# EAGLE design symasym_5_3 (EAGLE 4.15)
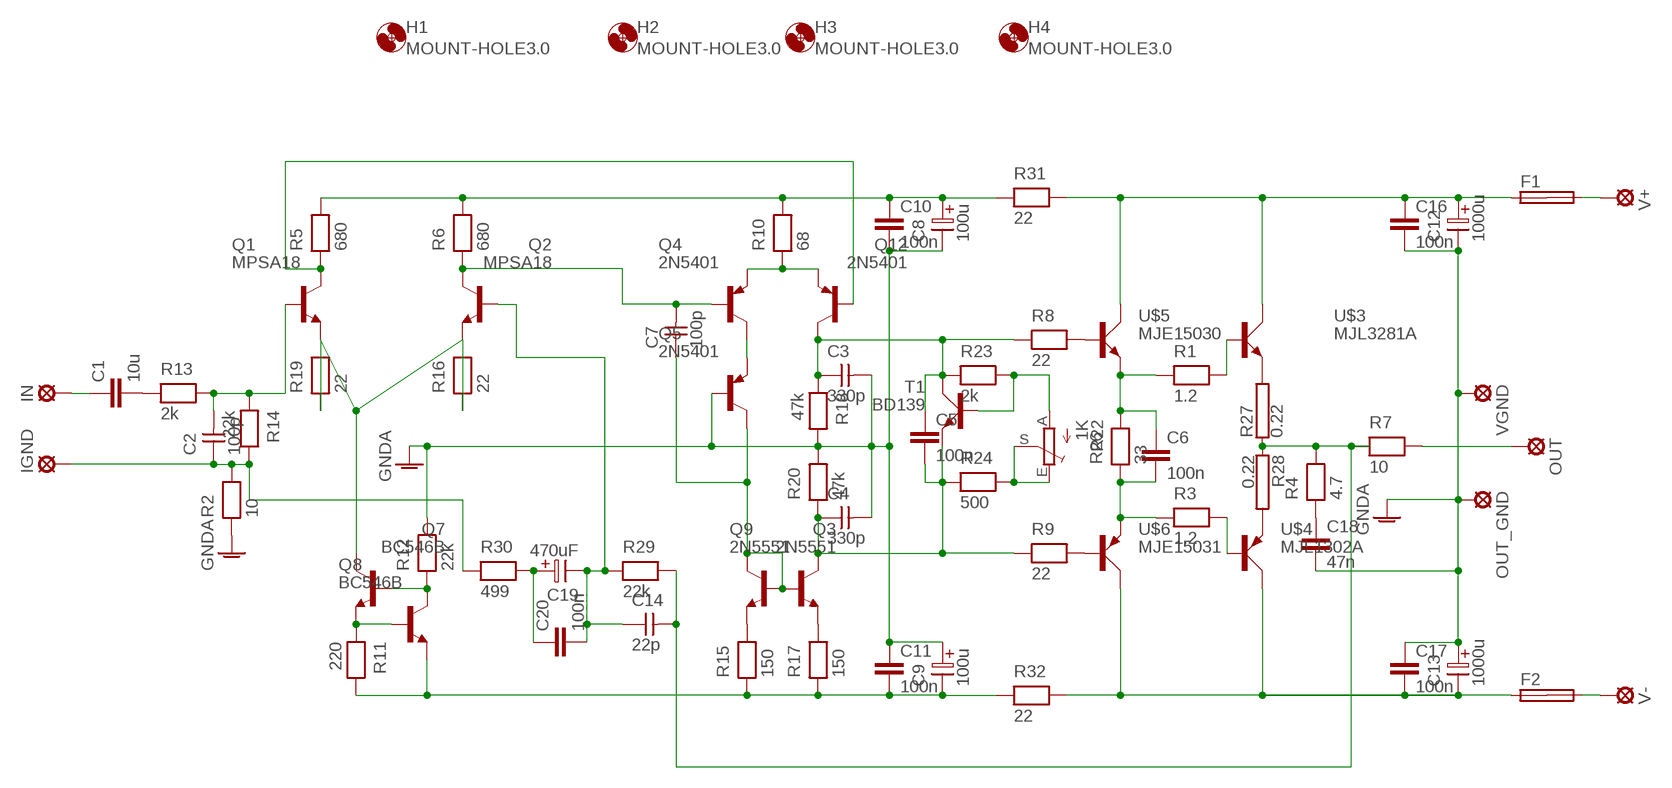
[diagram p0: schematic, sheet 1]

## Parts
C1  10u  C5/7.2  [C5B7.2]
C2  100p  CAPNP-2,5MICA  [C-3,75]
C3  330p  CAPNP-2,5MICA  [C-3,75]
C4  330p  CAPNP-2,5MICA  [C-3,75]
C5  100n  C5/2.5  [C5B2.5]
C6  100n  C5/3  [C5B3]
C7  100p  CAPNP-2,5MICA  [C-3,75]
C8  100u  ELC-5  [ES-5]
C9  100u  ELC-5  [ES-5]
C10  100n  C5/3.5  [C5B3.5]
C11  100n  C5/3.5  [C5B3.5]
C12  1000u  ELC-7,5  [ES-7,5]
C13  1000u  ELC-7,5  [ES-7,5]
C14  22p  CAPNP-2,5MICA  [C-3,75]
C16  100n  C5/3  [C5B3]
C17  100n  C5/3  [C5B3]
C18  47n  C5/3  [C5B3]
C19  470uF  ELC-5  [ES-5]
C20  100n  C5/3  [C5B3]
F1  SHK20L  [SHK20L]
F2  SHK20L  [SHK20L]
H1  MOUNT-HOLE3.0  [3,0]
H2  MOUNT-HOLE3.0  [3,0]
H3  MOUNT-HOLE3.0  [3,0]
H4  MOUNT-HOLE3.0  [3,0]
IGND  SE11  [SE11]
IN  SE11  [SE11]
OUT  SE11  [SE11]
OUT_GND  SE11  [SE11]
Q1  MPSA18  [TO92-EBC@1]
Q2  MPSA18  [TO92-EBC@1]
Q3  2N5551  [TO92-EBC@1]
Q4  2N5401  [TO92-EBC]
Q5  2N5401  [TO92-EBC]
Q7  BC546B  [TO92-EBC]
Q8  BC546B  [TO92-EBC]
Q9  2N5551  [TO92-EBC@1]
Q12  2N5401  [TO92-EBC]
R1  1.2  RESEU-18  [R-18]
R2  10  RESEU-10  [R-10]
R3  1.2  RESEU-18  [R-18]
R4  4.7  RESEU-18  [R-18]
R5  680  RESEU-10  [R-10]
R6  680  RESEU-10  [R-10]
R7  10  RESEU-18  [R-18]
R8  22  RESEU-10  [R-10]
R9  22  RESEU-10  [R-10]
R10  68  RESEU-10  [R-10]
R11  220  RESEU-S2,5  [RS-2,5]
R12  22k  RESEU-10  [R-10]
R13  2k  RESEU-S2,5  [RS-2,5]
R14  22k  RESEU-S2,5  [RS-2,5]
R15  150  RESEU-10  [R-10]
R16  22  RESEU-S2,5  [RS-2,5]
R17  150  RESEU-10  [R-10]
R18  47k  RESEU-S2,5  [RS-2,5]
R19  22  RESEU-S2,5  [RS-2,5]
R20  47k  RESEU-S2,5  [RS-2,5]
R22  1K  TRIM_EU-LI10  [LI10]
R23  2k  RESEU-10  [R-10]
R24  500  RESEU-10  [R-10]
R26  33  RESEU-10  [R-10]
R27  0.22  RKH208-8R  [KH208R-8]
R28  0.22  RKH208-8R  [KH208R-8]
R29  22k  RESEU-10  [R-10]
R30  499  RESEU-10  [R-10]
R31  22  RESEU-10  [R-10]
R32  22  RESEU-10  [R-10]
T1  BD139  [TO126AV]
U$3  MJL3281A  [TO247BV]
U$4  MJL1302A  [TO247BV]
U$5  MJE15030  [TO220AV]
U$6  MJE15031  [TO220AV]
V+  SE11  [SE11]
V-  SE11  [SE11]
VGND  SE11  [SE11]

## Nets
+24V: C8.1 C10.1 R5.2 R6.2 R10.2 R31.1
-24V: C9.2 C11.2 Q8.E R11.2 R15.1 R17.1 R32.1
N$1: Q3.E R15.2
N$2: R1.2 U$3.G(B)
N$3: Q7.C R16.2 R19.2
N$4: Q4.C Q5.E
N$5: R3.2 U$4.G(B)
N$6: Q9.E R17.2
N$7: C12.1 C16.1 F1.1A R31.2 U$3.D(C) U$5.C
N$8: C7.P$2 Q2.C Q4.B R6.1
N$9: C3.P$1 C5.1 Q12.C R8.1 R18.1 R23.1 T1.C
N$10: C7.P$1 Q3.B Q3.C Q5.C Q9.B
N$11: R8.2 U$5.B
N$12: R9.2 U$6.B
N$13: C1.2 R13.1
N$14: C18.1 R4.1
N$15: C2.P$1 IGND.MP R2.2 R14.2 R30.1
N$17: Q7.E Q8.B R11.1
N$18: Q4.E Q12.E R10.1
N$19: Q7.B Q8.C R12.1
N$20: C1.1 IN.MP
N$21: C2.P$2 Q1.B R13.2 R14.1
N$23: Q1.C Q12.B R5.1
N$27: C19.1 C20.1 R30.2
N$30: R22.A R23.2 T1.B
N$31: R22.E R22.S R24.2
N$32: C13.2 C17.2 F2.1A R32.2 U$4.D(C) U$6.C
N$33: C14.P$1 C19.2 C20.2 Q2.B R29.1
N$35: OUT.MP R7.2
N$37: R27.2 U$3.S(E)
N$38: R28.2 U$4.S(E)
N$41: C14.P$2 R4.2 R7.1 R27.1 R28.1 R29.2
N$42: F2.2A V-.MP
N$43: C4.P$1 C5.2 Q9.C R9.1 R20.1 R24.1 T1.E
N$44: F1.2A V+.MP
N$46: C6.1 R1.1 R26.2 U$5.E
N$47: C6.2 R3.1 R26.1 U$6.E
N$68: C3.P$2 C4.P$2 C8.2 C9.1 C10.2 C11.1 C12.2 C13.1 C16.2 C17.1 C18.2 OUT_GND.MP Q5.B R2.1 R12.2 R18.2 R20.2 VGND.MP ; supply symbol labelled GNDA
N$69: Q2.E R16.1
N$70: Q1.E R19.1
Unconnected: F1.1B F1.2B F2.1B F2.2B

## Library data of the parts
C1 C5 C6 C10 C11 C16-C18 C20 = capacitor-wima:C: CAPACITOR naming: grid - package width
C2-C4 C7 C14 = discrete:CAPNP-2,5
C8 C9 C19 = discrete:ELC-5
C12 C13 = discrete:ELC-7,5
F1 F2 = fuse:SHK20L: FUSE HOLDER 5 x 20 mm, SH contact, SHH1 Schukat, E1073 Buerklin
H1-H4 = holes:MOUNT-HOLE: MOUNTING HOLE with drill center marker
IGND IN OUT OUT_GND V+ V- VGND = solpad:SE11: SOLDER PAD RTM, drill 1,1mm, distributor Buerklin, 07F810
Q1 Q2 = transistor-npn:MPSA18
Q3 Q9 = transistor-npn:2N5551
Q4 Q5 Q12 = transistor-pnp:2N5401
Q7 Q8 = transistor-npn:BC546*: NPN Transistor
R1 R3 R4 R7 = discrete:RESEU-18
R2 R5 R6 R8-R10 R12 R15 R17 R23 R24 R26 R29-R32 = discrete:RESEU-10
R11 R13 R14 R16 R18-R20 = discrete:RESEU-S2,5
R22 = pot:TRIM_EU-: POTENTIOMETER
R27 R28 = resistor-power:R: Power Resitor
T1 = transistor-power:BD139: NPN TRANSISTOR
U$3 = transistor-power:MJL3281A
U$4 = transistor-power:MJL1302A
U$5 = transistor-power:MJE15030
U$6 = transistor-power:MJE15031

## Board
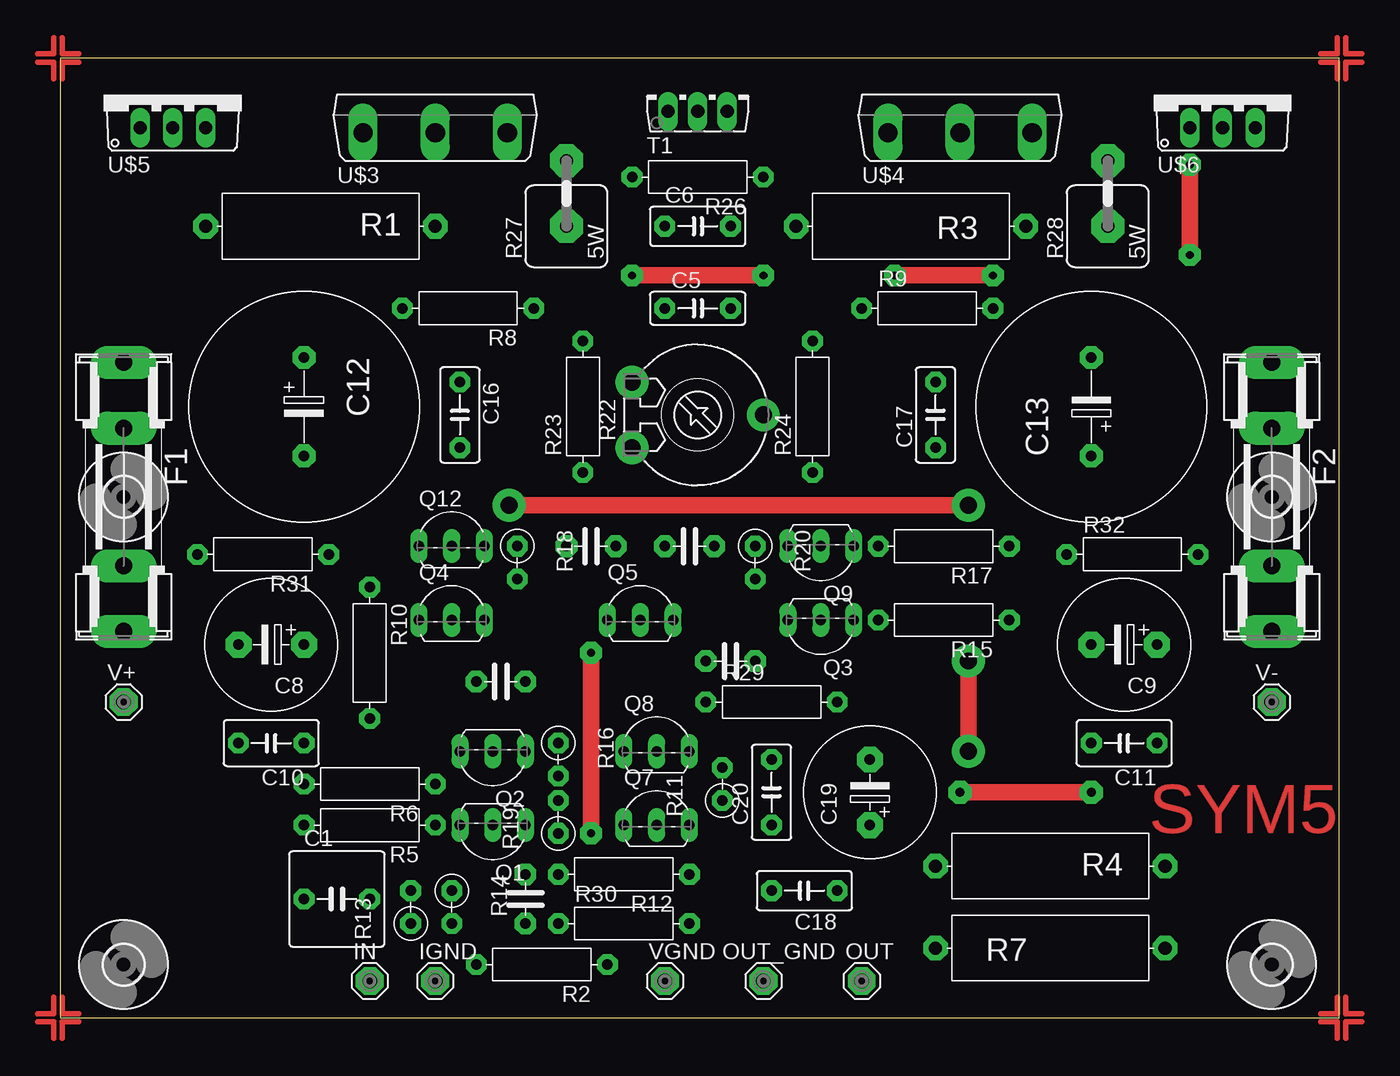
[diagram p1: board, top side]
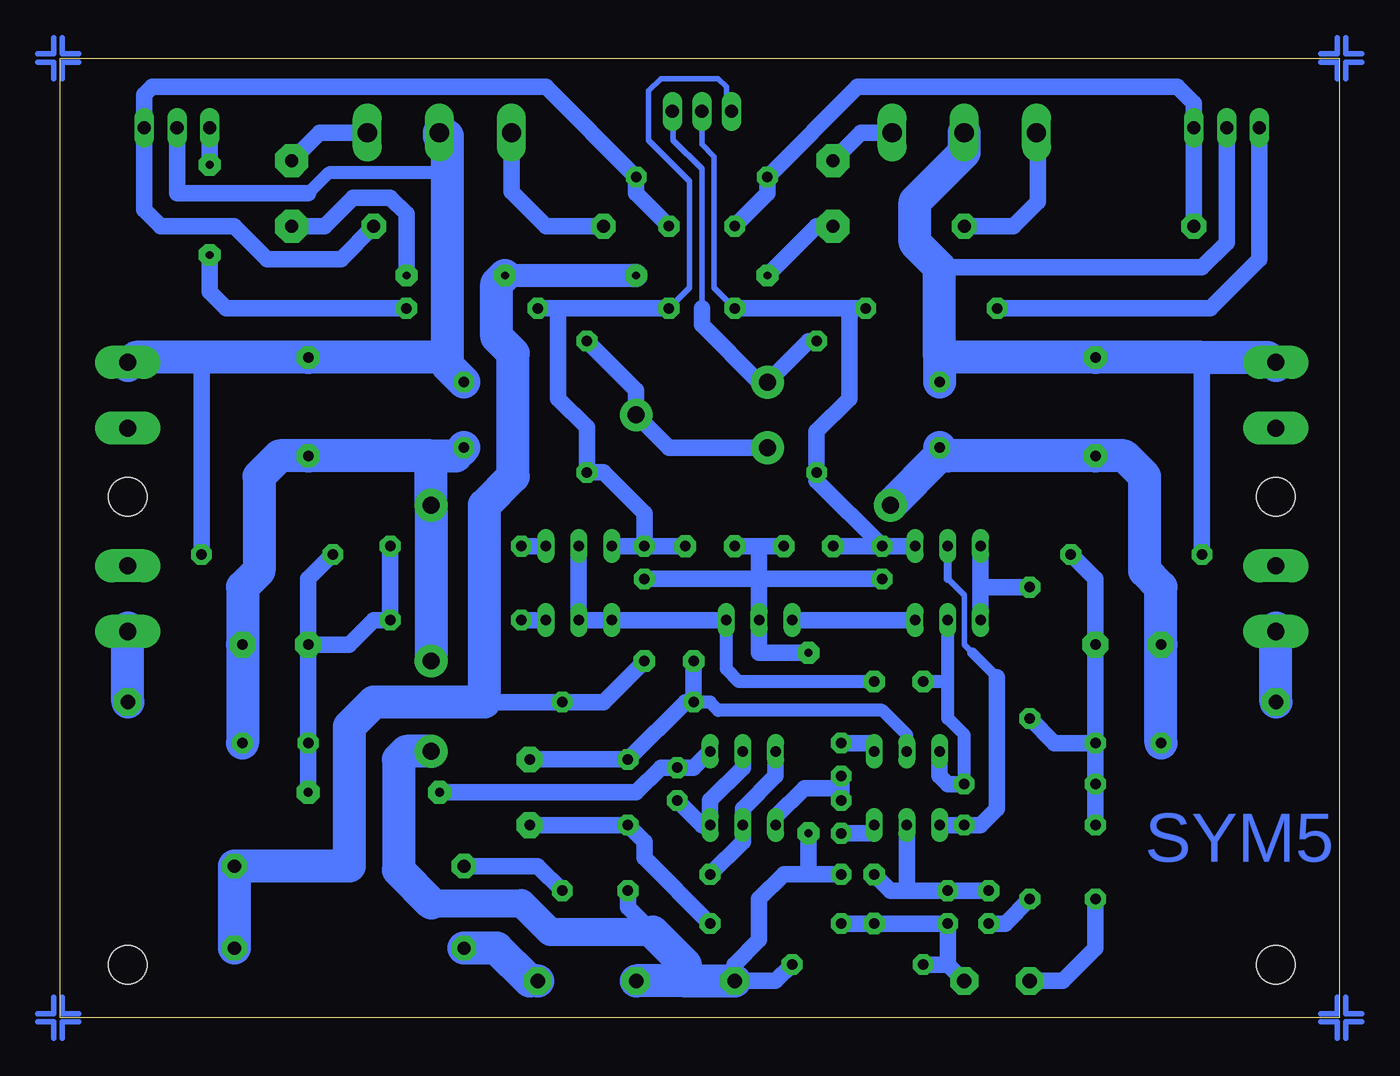
[diagram p2: board, bottom side, seen from below]

Size 99.05 x 74.28 mm. Coordinates in mm from the lower left corner, seen from the top.
Outline: 0,0 99.05,0 99.05,74.28 0,74.28 0,0
Copper layers (1*16): Top 0.035mm / dielectric 1.5mm / Bottom 0.035mm
Design rules "default": minimum track width 10mil, minimum drill 24mil, track to track 8mil, track to pad 8mil, pad to pad 8mil, via to via 8mil, smd to smd 8mil, copper to edge 40mil, drill to drill 8mil, minimum pad ring 10mil, minimum via ring 8mil, stop-mask expansion 4mil, vias tented up to drill 0mil, thermal gap 10mil

### Footprints (pad centres in the part's own frame; a part is rotated, then mirrored left to right if it is on the bottom)
C5B7.2 = drill 0.813 pad 1.6 octagon: 1 -2.54,0; 2 2.54,0
C-3,75 = drill 0.813 pad 1.676 octagon: P$1 -1.905,0; P$2 1.905,0
C5B2.5 = drill 0.813 pad 1.6 octagon: 1 -2.54,0; 2 2.54,0
C5B3 = drill 0.813 pad 1.6 octagon: 1 -2.54,0; 2 2.54,0
ES-5 = drill 0.813 pad 2.007 octagon: 1 -2.54,0; 2 2.54,0
C5B3.5 = drill 0.813 pad 1.6 octagon: 1 -2.54,0; 2 2.54,0
ES-7,5 = drill 0.813 pad 1.778 octagon: 1 -3.81,0; 2 3.81,0
SHK20L = drill 1.321 pad 2.54 long: 1A -10.414,0; 1B -5.334,0; 2A 10.414,0; 2B 5.334,0
3,0 = hole 3: 0,0
SE11 = drill 1.118 pad 2.159 octagon: MP 0,0
TO92-EBC@1 = drill 0.813 long: B 0,0; C 2.54,0; E -2.54,0
TO92-EBC = drill 0.813 long: B 0,-1.27; C -2.54,-1.27; E 2.54,-1.27
R-18 = drill 1.016 pad 1.905 octagon: 1 -8.89,0; 2 8.89,0
R-10 = drill 0.813 pad 1.6 octagon: 1 -5.08,0; 2 5.08,0
RS-2,5 = drill 0.813 pad 1.6 octagon: 1 0,0; 2 2.54,0
LI10 = drill 1.321 pad 2.54 round: A -2.54,-5.08; E 2.54,-5.08; S 0,5.08
KH208R-8 = drill 1.016 pad 2.54 octagon: 1 -2.54,0; 2 2.54,0
TO126AV = drill 1.016 long: B 2.286,-1.27; C 0,-1.27; E -2.286,-1.27
TO247BV = drill 1.499 long: D 0,-2.921; G -5.588,-2.921; S 5.588,-2.921
TO220AV = drill 1.016 long: B -2.54,-2.54; C 0,-2.54; E 2.54,-2.54

### Placement (x,y rotation side)
C1  21.43,9.2 0 top
C2  36.03,9.2 90 top
C3  41.11,36.51 0 top
C4  48.73,36.51 180 top
C5  49.36,54.92 0 top
C6  49.36,61.27 0 top
C7  34.12,26.03 180 top
C8  16.34,28.89 180 top
C9  82.39,28.89 180 top
C10  16.34,21.27 180 top
C11  82.39,21.27 180 top
C12  18.89,47.3 270 top
C13  79.84,47.3 90 top
C14  51.9,27.62 0 top
C16  30.95,46.67 270 top
C17  67.78,46.67 90 top
C18  57.62,9.84 180 top
C19  62.7,17.46 90 top
C20  55.08,17.46 90 top
F1  4.92,40.32 270 top
F2  93.81,40.32 270 top
H1  93.81,4.12 0 top
H2  4.92,4.12 0 top
H3  93.81,40.32 0 top
H4  4.92,40.32 0 top
IGND  29.05,2.85 0 top
IN  23.96,2.85 0 top
OUT  62.06,2.85 0 top
OUT_GND  54.45,2.85 0 top
Q1  33.49,14.92 180 top
Q2  33.49,20.63 180 top
Q3  58.89,30.79 180 top
Q4  2N5401  [TO92-EBC@1]  30.32,30.79 0 top
Q5  2N5401  [TO92-EBC@1]  44.92,30.79 0 top
Q7  46.19,16.19 0 top
Q8  46.19,21.9 0 top
Q9  58.89,36.51 180 top
Q12  2N5401  [TO92-EBC@1]  30.32,36.51 0 top
R1  20.16,61.27 0 top
R2  37.3,4.12 180 top
R3  65.88,61.27 180 top
R4  76.67,11.74 0 top
R5  23.96,14.92 180 top
R6  23.96,18.09 180 top
R7  76.67,5.39 180 top
R8  31.59,54.92 180 top
R9  67.15,54.92 0 top
R10  23.96,28.25 270 top
R11  51.27,16.82 90 top
R12  43.65,11.11 180 top
R13  27.14,7.3 90 top
R14  30.32,9.84 270 top
R15  68.42,30.79 180 top
R16  38.57,21.27 270 top
R17  68.42,36.51 180 top
R18  35.39,36.51 270 top
R19  38.57,14.28 90 top
R20  53.81,36.51 270 top
R22  49.36,46.67 270 top
R23  40.47,47.3 90 top
R24  58.25,47.3 90 top
R26  49.36,65.08 180 top
R27  39.2,63.81 90 top
R28  81.12,63.81 90 top
R29  55.08,24.44 0 top
R30  43.65,7.3 0 top
R31  15.71,35.87 180 top
R32  83.02,35.87 0 top
T1  49.36,71.43 0 top
U$3  29.05,71.43 0 top
U$4  69.69,71.43 0 top
U$5  8.72,71.43 0 top
U$6  90.01,71.43 0 top
V+  4.92,24.44 0 top
V-  93.81,24.44 0 top
VGND  46.82,2.85 0 top

### Tracks (layer width: path | path; a pad name or v marks a point on that pad's centre or on a via)
+24V
  Bottom 1.27: R31.1 18.89,33.97 C8.1 C10.1 | R5.2 R6.2 C10.1 | C10.1 22.06,21.27 R10.2
-24V  (via drill 0.7 pad 1.78)
  Top 1.27: v69.69,17.46 v79.84,17.46
  Bottom 1.27: C9.2 79.84,33.97 R32.1 | C9.2 C11.2 v79.84,17.46 | R17.1 R15.1 74.77,30.79 76.67,28.89 C9.2 | Q8.E 50,19.36 R11.2 52.54,19.36 54.45,17.46 v69.69,17.46
N$1
  Bottom 1.27: Q3.E R15.2
N$2
  Bottom 1.27: R1.2 25.23,61.27 23.33,63.18 23.33,68.89 23.46,68.77 U$3.G
N$3
  Bottom 1.27: Q7.C 43.65,15.55 41.43,17.77 38.57,17.77 | R19.2 38.57,17.77 | 38.57,17.77 R16.2
N$4
  Bottom 1.27: Q4.C Q5.E
N$5
  Bottom 1.27: U$4.G 64.1,63.94 61.43,61.27 R3.2
N$6
  Bottom 1.27: Q9.E R17.2
N$7
  Bottom 1.27: U$5.C 8.72,60 10.63,58.1 30.95,58.1 | R31.2 10.63,51.11
  Bottom 2.54: 30.95,51.11 C12.1 10.63,51.11 5.55,51.11 4.92,50.48 F1.1A | 30.95,51.11 C16.1 | 30.95,51.11 30.95,58.1 32.85,60 32.85,63.18 29.05,66.99 U$3.D
N$8
  Bottom 1.016: R6.1 29.05,21.9 30.32,23.17 30.32,26.03 | 30.32,26.03 Q4.B | 30.32,26.03 C7.P$2
  Bottom 1.27: R6.1 30.32,18.09 30.95,18.73 Q2.C
N$9
  Bottom 0.406: C5.1 48.41,56.51 48.41,66.67 49.36,67.62 T1.C
  Bottom 1.27: 37.93,54.92 C5.1 | 37.93,54.92 R8.1 | Q12.C R18.1 | R18.1 C3.P$1 | 37.93,54.92 37.93,47.94 40.47,45.4 R23.1 40.47,41.59 R18.1
N$10
  Bottom 1.016: C7.P$1 46.51,26.03 47.46,26.98 Q5.C
  Bottom 1.27: Q5.C Q3.C Q3.B Q9.B
N$11
  Bottom 1.27: R8.2 10,54.92 6.19,58.73 U$5.B
N$12  (via drill 0.61 pad 1.68)
  Top 1.27: v87.47,59.05 v87.47,66.03
  Bottom 1.27: R9.2 86.2,54.92 87.47,56.19 v87.47,59.05 | v87.47,66.03 U$6.B
N$13
  Bottom 1.27: C1.2 25.87,7.3 R13.1
N$14
  Bottom 1.27: C18.1 62.06,11.74 R4.1
N$15
  Bottom 1.27: R30.1 C2.P$1 R14.2 30.32,4.12 | IGND.MP 30.32,4.12 | 30.32,4.12 R2.2
N$16
  Top 0.406: 1.42,-0.32 0.15,-0.32 0.15,-1.59
N$17
  Bottom 1.27: Q8.B 46.19,19.36 48.73,16.82 Q7.E 49.36,14.92 R11.1
N$18
  Bottom 1.27: Q4.E 27.78,33.33 | 27.78,33.33 Q12.E | 27.78,33.33 R10.1
N$19
  Bottom 1.27: Q8.C 43.65,18.73 46.19,16.19 Q7.B 46.19,13.65 R12.1
N$20
  Bottom 1.27: IN.MP 21.43,2.85 18.89,5.39 C1.1
N$21
  Bottom 1.27: 33.49,9.84 R14.1 R13.2 | 33.49,9.84 Q1.B | 33.49,9.84 34.76,9.84 C2.P$2
N$22
  Top 0.406: -0.48,-1.59 -0.48,-0.32 -1.75,-0.32
N$23
  Bottom 0.406: 30.32,33.97 29.05,32.7 29.05,28.89 28.41,28.25
  Bottom 0.61: 30.32,33.97 Q12.B
  Bottom 0.813: 26.5,26.35 28.41,28.25
  Bottom 1.27: Q1.C R5.1 27.78,14.92 26.5,16.19 26.5,26.35
N$24
  Top 0.406: 1.42,0.31 0.15,0.31 0.15,1.58
N$25
  Top 0.406: -1.75,0.31 -0.48,0.31 -0.48,1.58
N$26
  Top 0.406: 1.42,74.61 0.15,74.61 0.15,75.88
N$27
  Bottom 1.27: C19.1 C20.1 53.81,13.65 53.81,12.38 R30.2
N$28
  Top 0.406: -0.48,75.88 -0.48,74.61 -1.75,74.61
N$29
  Top 0.406: -1.75,73.97 -0.48,73.97 -0.48,72.7
N$30
  Bottom 0.406: T1.B 51.59,70.1 51.59,67.94 49.36,65.72 49.36,54.92
  Bottom 1.27: 49.36,54.92 49.36,53.65 44.92,49.21 R22.A 41.11,52.38 R23.2
N$31
  Bottom 1.27: R24.2 54.45,48.57 R22.S 51.9,44.13 R22.E
N$32
  Bottom 1.016: 69.05,65.4 78.26,65.4 79.84,63.81
  Bottom 1.27: 79.84,63.81 90.01,63.81 U$6.C | 88.1,51.11 R32.2
  Bottom 2.54: 69.05,51.11 C13.2 88.1,51.11 93.18,51.11 93.81,50.48 F2.1A | 69.05,51.11 69.05,65.4 69.05,68.26 69.69,68.26 U$4.D | C17.2 69.05,50.48 69.05,51.11
N$33
  Bottom 0.813: Q2.B 33.49,21.9
  Bottom 1.016: 33.49,21.9 35.39,23.81 48.09,23.81 48.73,24.44 R29.1
  Bottom 1.27: C14.P$1 R29.1 50.63,24.44 C20.2 C19.2
N$34
  Top 0.406: 0.15,72.7 0.15,73.97 1.42,73.97
N$35
  Bottom 2.54: OUT.MP 62.7,2.85 65.24,5.39 R7.2
N$36
  Top 0.406: 97.62,74.61 98.9,74.61 98.9,75.88
N$37
  Bottom 1.27: U$3.S 37.05,68.51 R27.2
N$38
  Bottom 1.27: U$4.S 78.96,68.51 R28.2
N$39
  Top 0.406: 99.53,75.88 99.53,74.61 100.8,74.61
N$40
  Top 0.406: 100.8,73.97 99.53,73.97 99.53,72.7
N$41  (via drill 0.61 pad 1.68)
  Top 1.27: v54.45,57.46 v44.28,57.46 | v64.61,57.46 v72.23,57.46
  Bottom 1.27: R28.1 78.58,61.27 76.35,63.5 73.5,63.5 72.23,62.23 v72.23,57.46 | v44.28,57.46 40.47,61.27 R27.1 | 66.19,24.44 R29.2 56.98,24.44 C14.P$2
  Bottom 1.778: v64.61,57.46 v54.45,57.46
  Bottom 2.54: v64.61,57.46 65.24,56.83 65.24,52.7 63.97,51.43 63.97,41.9 66.19,39.68 66.19,24.44 74.77,24.44 76.67,22.54 76.67,11.74 R4.2 R7.1
N$42
  Bottom 2.54: 93.81,30.16 F2.2A V-.MP
N$43
  Bottom 0.305: 46.82,70.16 T1.E
  Bottom 0.406: C5.2 50.32,56.51 50.32,64.76 53.49,67.94 53.49,71.75 52.54,72.7 48.09,72.7 47.46,72.07 47.46,70.8 46.82,70.16
  Bottom 1.27: 60.48,54.92 C5.2 | R20.1 Q9.C | R20.1 53.81,39.05 56.98,42.22 R24.1 58.25,45.71 60.48,47.94 60.48,54.92 | C4.P$1 R20.1 | 60.48,54.92 R9.1
N$44
  Bottom 2.54: 4.92,30.16 F1.2A V+.MP
N$45
  Top 0.406: 98.9,72.7 98.9,73.97 97.62,73.97
N$46
  Bottom 1.27: R1.1 U$5.E 11.27,70.8 12.54,72.07 37.3,72.07 R26.2 44.28,63.81 C6.1
N$47
  Bottom 1.27: R3.1 77.31,58.73 83.02,58.73 85.56,61.27 91.28,61.27 92.55,62.54 U$6.E 92.55,71.43 91.91,72.07 61.43,72.07 R26.1 54.45,63.81 C6.2
N$48
  Top 0.406: 97.62,0.31 98.9,0.31 98.9,1.58
N$49
  Top 0.406: 99.53,1.58 99.53,0.31 100.8,0.31
N$50
  Top 0.406: 100.8,-0.32 99.53,-0.32 99.53,-1.59
N$51
  Top 0.406: 98.9,-1.59 98.9,-0.32 97.62,-0.32
N$52
  Bottom 0.406: -1.75,0.31 -0.48,0.31 -0.48,1.58
N$53
  Bottom 0.406: 0.15,1.58 0.15,0.31 1.42,0.31
N$54
  Bottom 0.406: 1.42,-0.32 0.15,-0.32 0.15,-1.59
N$55
  Bottom 0.406: -0.48,-1.59 -0.48,-0.32 -1.75,-0.32
N$56
  Bottom 0.406: 98.9,-1.59 98.9,-0.32 97.62,-0.32
N$57
  Bottom 0.406: 99.53,-1.59 99.53,-0.32 100.8,-0.32
N$58
  Bottom 0.406: 100.8,0.31 99.53,0.31 99.53,1.58
N$59
  Bottom 0.406: 98.9,1.58 98.9,0.31 97.62,0.31
N$60
  Bottom 0.406: 98.9,75.88 98.9,74.61 97.62,74.61
N$61
  Bottom 0.406: 97.62,73.97 98.9,73.97 98.9,72.7
N$62
  Bottom 0.406: 99.53,72.7 99.53,73.97 100.8,73.97
N$63
  Bottom 0.406: 100.8,74.61 99.53,74.61 99.53,75.88
N$64
  Bottom 0.406: -1.75,73.97 -0.48,73.97 -0.48,72.7
N$65
  Bottom 0.406: 0.15,72.7 0.15,73.97 1.42,73.97
N$66
  Bottom 0.406: 1.42,74.61 0.15,74.61 0.15,75.88
N$67
  Bottom 0.406: -0.48,75.88 -0.48,74.61 -1.75,74.61
N$68  (via drill 0.61 pad 1.68, 1.3 pad 2.54)
  Top 1.27: v41.11,14.28 v41.11,28.25 | v70.32,27.62 v70.32,20.63 | v34.76,39.68 v70.32,39.68
  Bottom 1.27: C10.2 C8.2 | v41.11,28.25 44.92,28.25 Q5.B 44.92,33.97 | 44.92,36.51 C3.P$2 | 44.92,36.51 C4.P$2 | 44.92,33.97 44.92,36.51 | 44.92,33.97 R18.2 | 44.92,33.97 R20.2 | 41.11,11.11 43.01,11.11 44.92,9.2 44.92,6.03 46.82,4.12 VGND.MP 43.65,2.85 R2.1 | 41.11,11.11 R12.2 | 41.11,11.11 v41.11,14.28 | 53.17,6.66 55.08,8.57 C18.2
  Bottom 2.184: 53.17,6.66 61.11,6.66 63.33,8.89 70.32,8.89
  Bottom 2.54: 30.32,43.49 C12.2 16.66,43.49 15.08,41.9 15.08,34.6 13.8,33.33 C8.2 C10.2 | 30.32,43.49 C16.2 30.95,43.49 | 50.63,2.85 VGND.MP | 50.63,2.85 OUT_GND.MP | C11.1 C9.1 84.92,33.33 83.66,34.6 83.66,41.9 82.07,43.49 C13.1 70.32,43.49 | 30.32,43.49 30.95,43.49 | 30.95,43.49 v34.76,39.68 | v70.32,27.62 v70.32,39.68 70.32,43.49 | v70.32,20.63 72.23,20.63 72.86,20 72.86,11.43 70.32,8.89 | 53.17,6.66 50.63,4.12 50.63,2.85 | 70.32,43.49 68.42,43.49 C17.1
N$69
  Bottom 1.27: R16.1 36.03,21.27 Q2.E
N$70
  Bottom 1.27: R19.1 36.03,14.28 Q1.E

### Text on the board
Top: SYM5
Bottom: SYM5